# Altium schematic sheet zasilanie.SchDoc
size A4
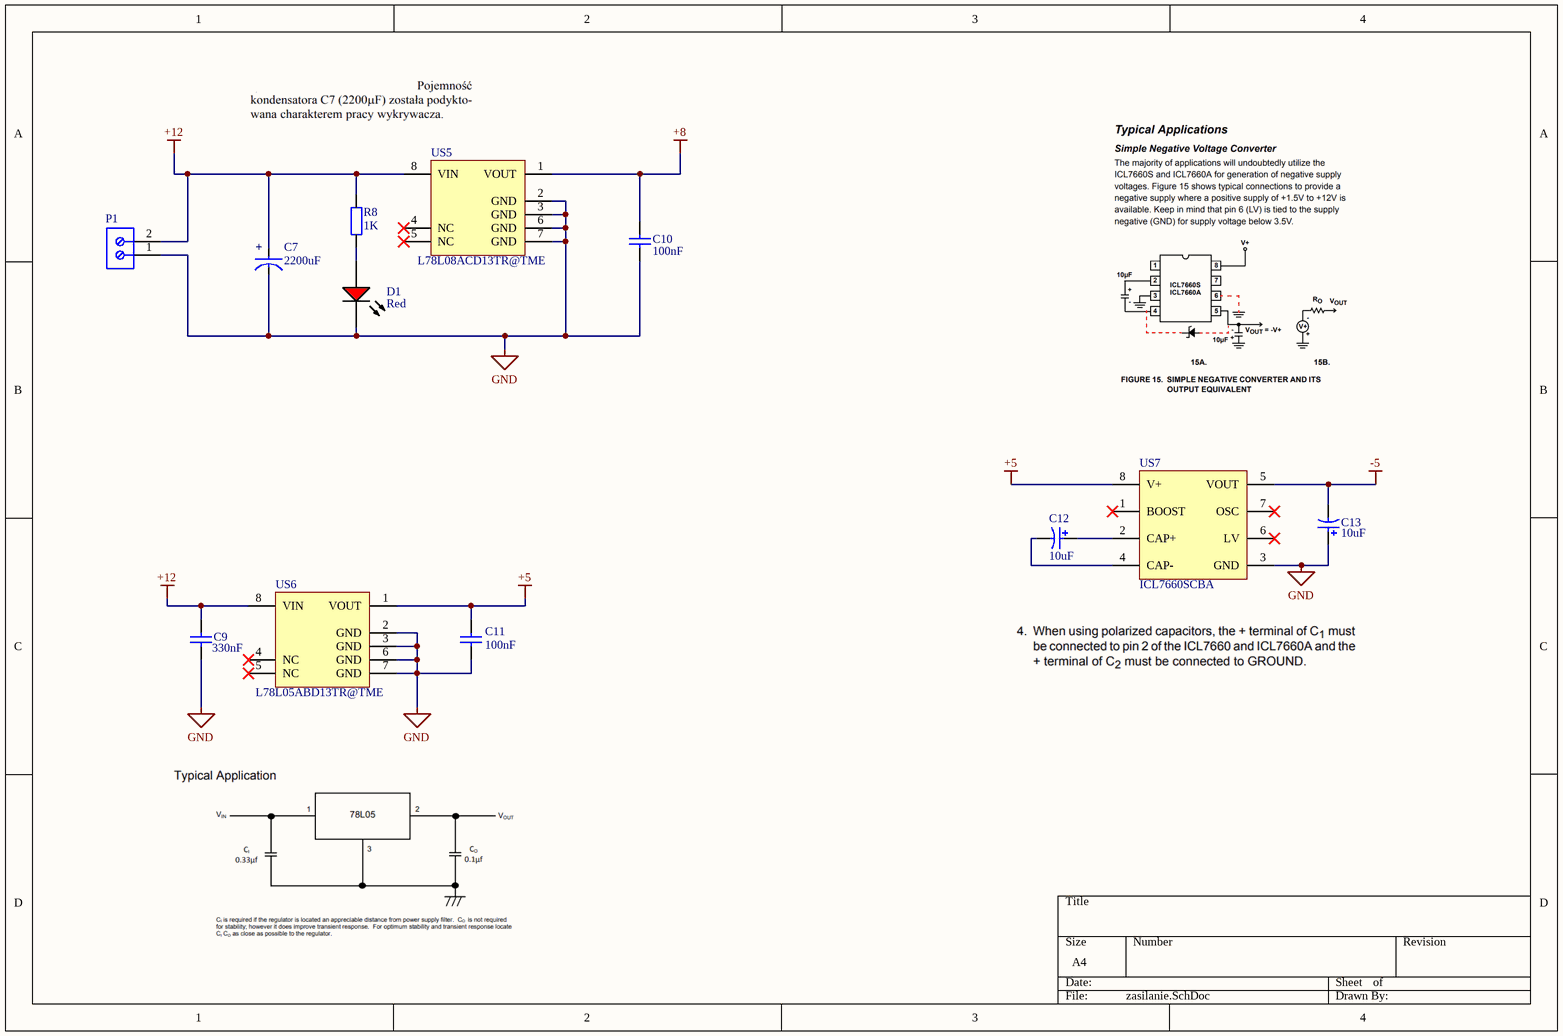
[diagram p0: zasilanie.SchDoc]

## Parts
C7  Capacitance: 2200uF  [18 X 25mm Radial 7.5mm]  (hidden comment: Cap Electrolytic)
C9  value 330nF  [CAPC1608X90X35ML15T15]  (hidden comment: 0603YD334KAT2A)
C10  Capacitance: 100nF  [0603]  (hidden comment: CL10B104KA8NNNC@TME)
C11  Capacitance: 100nF  [0603]  (hidden comment: CL10B104KA8NNNC@TME)
C12  Capacitance: 10uF  [PNSC-FK-V-D_V]  (hidden comment: EEEFK1H100P)
C13  Capacitance: 10uF  [PNSC-FK-V-D_V]  (hidden comment: EEEFK1H100P)
D1  LED Colour: Red  [VISH-TLMS1000_V]  (hidden comment: TLMS1000-GS08)
P1  282836-2@TME  [TECO-282836-2_V]  (value not drawn)
R8  value 1K  [R1206]  (hidden comment: 1206S4J0102T5E@TME)
US5  L78L08ACD13TR@TME  [SO8_M]
US6  L78L05ABD13TR@TME  [SO8_N]
US7  ICL7660SCBA  [INTS-SOIC-8_V]

## Nets
+5: C11.1 US6.1(VOUT) US7.8(V+)
+8: C10.1 US5.1(VOUT)
+12: C7.2(+) C9.1 P1.2(-) R8.2 US5.8(VIN) US6.8(VIN)
-5: C13.2 US7.5(VOUT)
GND: C7.1(-) C9.2 C10.2 C11.2 C13.1 D1.2(K) P1.1(+) US5.2(GND) US5.3(GND) US5.6(GND) US5.7(GND) US6.2(GND) US6.3(GND) US6.6(GND) US6.7(GND) US7.3(GND)
NetC12_1: C12.1 US7.2(CAP+)
NetC12_2: C12.2 US7.4(CAP-)
NetD1_1: D1.1(A) R8.1

Not connected (* = marked no-connect by the designer): US5 4(NC)* 5(NC)*; US6 4(NC)* 5(NC)*; US7 1(BOOST)* 6(LV)* 7(OSC)*

## Library data of the parts
C7 = Cap Electrolytic: CAPACITOR ALUM 2200UF 20% 35V RADIAL
C9 = CMP-2006-04538-1: Manufacturer: AVX Interconnect / Elco; Part Number: 0603YD334KAT2A
C10 C11 = Cap: Capacitor
C12 C13 = CMP-2000-06207-1: Aluminum Electrolytic Capacitor, 10 uF, +/- 20%, 50 V, 2-Pin SMD (Size Code D), -55 to 105 degC, RoHS, Tape and Reel; Manufacturer: Panasonic; Lifetime@Temperature: 2000Hrs@105°C; Type: Can; Rated Voltage: 50V; Ripple Current: 165mA; Impedance: 0.88O; Manufacturer URL: http://www.panasonic.com/; Mounting Technology: SurfaceMount; Datasheet URL: http://industrial.panasonic.com/cdbs/www-data/pdf/RDE0000/ABA0000C1181.pdf; Package Reference: FK-V-D; Series: FK; Operating Temp Range: -55to+105°C; Operating Temp-Max: 105°C; Datasheet Version: 03/2016; Package URL: http://industrial.panasonic.com/cdbs/www-data/pdf/RDE0000/DME0000COL48.pdf; Case Size/Dimension: Ø6.3x5.8mm; Package Description: 2-Pin Electrolytic Aluminum Capacitor, Body 6.6 x 6.6 mm
D1 = CMP-2000-07254-1: Low Current LED, 40 mW, 1.8 V, -40 to 100 degC, 2-Pin SMD (0603), RoHS, Tape and Reel; Manufacturer: Vishay; Lens Shape: Rectangular; Automotive Qualification Standard: AEC-Q100; Wavelength Typ: 636nm; SVHC: ToBeAdvised; Bulb Size: 1.6mmx0.8mm; Forward Voltage: 1.8V; Luminous Intensity: 4mcd; Forward Current If: 2mA; Viewing Angle: 80°; Datasheet Version: Rev. 1.7, 02/2011; Datasheet URL: https://datasheet.ciiva.com/5798/1698881-5798337.pdf; LED Mounting: SMD; Packaging: CutTape; Package Reference: TLMS1000; Manufacturer URL: http://www.vishay.com/; Mounting Technology: SurfaceMount; Product Range: -; Package Description: 2-Pin Surface Mount Device, Body 1.6 x 0.8 mm; MSL: MSL2-1year
P1 = CMP-1684-00017-1: Female Header, Pitch 5 mm, 1 x 2 Position, Height 10 mm, Tail Length 3.5 mm, Rohs, Bulk; Manufacturer: TE Connectivity; Wire Gauge: 16-30AWG; Product Training Modules: Wire-to-BoardEurostyleTerminalBlocks; Clamp Material - Plating: Brass-NickelPlated; Voltage: 300V; Mating Orientation: HorizontalwithBoard; Current: 13.5A; Pitch: 0.197"(5.00mm); Screw Thread: M3; 3D Model: 282836-2.pdf; Other Names: 5ULV-02B / A98076; Dynamic Catalog: BuchananSeries; Number of Levels: 1; Torque - Screw: 0.68Nm(6Lb-In); Featured Product: EurostyleTerminalBlockConnectors; Positions Per Level: 2; Wire Termination: Screw-RisingCageClamp; Datasheet URL: http://www.te.com.cn/commerce/DocumentDelivery/DDEController?Action=showdoc&DocId=Catalog+Section%7F1308389_EUROSTYLE_TERMINAL_BLOCKS%7F0607%7Fpdf%7FEnglish%7FENG_CS_1308389_EUROSTYLE_TERMINAL_BLOCKS_0607.pdf%7F282836-2; Color: Green; Family: TerminalBlocks-WiretoBoard; RoHS Information: 282836-2StatementofCompliance; Standard Package: 300; Contact Material - Plating: Brass-TinPlated; Manufacturer URL: http://www.te.com; Housing Material: Polyamide(PA66),Nylon6/6; Features: Interlocking(Side); Package Description: Female Header, Pitch 5 mm, 1 x 2 Position, Height 10 mm, Tail Length 3.5 mm; Mounting Type: ThroughHole; Package Reference: THD; Packaging: Bulk; Series: Buchanan; Category: Connectors,Interconnects; Screw Material - Plating: Brass-NickelPlated
R8 = Res: Resistor
US5 = CMP-0244-00234-1: Positive Voltage Regulator, 8V, 8-Pin SO, Tape and Reel; PackageVersion: 1/12/2002; DatasheetVersion: 1/02/2011; Code_IPC: SOIC127P600-8; PackageDescription: 8-Pin Small Outline Integrated Circuit 1.27 mm Pitch; ComponentLink3Description: Package Specification; Code_JEDEC: MS-012-AA; PackageReference: SO8; ComponentLink3URL: http://www.st.com/internet/com/TECHNICAL_RESOURCES/TECHNICAL_LITERATURE/PACKAGE_INFORMATION/CD00004680.pdf; ComponentLink1Description: Manufacturer URL; ComponentLink2Description: Datasheet; ComponentLink2URL: http://www.st.com/internet/com/TECHNICAL_RESOURCES/TECHNICAL_LITERATURE/DATASHEET/CD00000446.pdf; ComponentLink1URL: http://www.st.com
US6 = CMP-0244-00242-1: Positive Voltage Regulator, 5V, 8-Pin SO, Tape and Reel; ComponentLink2URL: http://www.st.com/internet/com/TECHNICAL_RESOURCES/TECHNICAL_LITERATURE/DATASHEET/CD00000446.pdf; ComponentLink3URL: http://www.st.com/internet/com/TECHNICAL_RESOURCES/TECHNICAL_LITERATURE/PACKAGE_INFORMATION/CD00004680.pdf; Code_IPC: SOIC127P600-8; PackageDescription: 8-Pin Small Outline Integrated Circuit 1.27 mm Pitch; ComponentLink3Description: Package Specification; ComponentLink2Description: Datasheet; DatasheetVersion: 1/02/2011; PackageVersion: 1/12/2002; Code_JEDEC: MS-012-AA; ComponentLink1URL: http://www.st.com; ComponentLink1Description: Manufacturer URL; PackageReference: SO8
US7 = CMP-2000-06437-1: Charge Pump Switching Regulator IC Positive or Negative Fixed, 1.5 to 12 V, 0 to 70 degC, RoHS, Tube; Manufacturer: Intersil; Number of Outputs: 1; Frequency - Switching: 10kHz,35kHz; Dynamic Catalog: InvertingIC; Current - Output: 45mA; Voltage - Input: 1.5V~12V; Output Type: Adjustable; Synchronous Rectifier: No; Voltage - Output: -1.5V~-12V,±3V~±24V; Package URL: http://www.intersil.com/content/dam/Intersil/documents/m8_1/m8.15.pdf; Standard Package: 98; Type: SwitchedCapacitor(ChargePump),Doubler,Inverting; Datasheet Version: 01/2013; Package Description: 8-Pin Small Outline Integrated Circuit, Body 4.9 x 3.9 mm, Pitch 1.27 mm; Category: IntegratedCircuits(ICs); Operating Temperature: 0°C~70°C; Mounting Technology: SurfaceMount; Package / Case: 8-SOIC(0.154",3.90mmWidth); Mounting Type: SurfaceMount; Series: -; Family: PMIC-VoltageRegulators-DCDCSwitchingRegulators; Packaging: Tube; PWM Type: -; Supplier Device Package: 8-SOIC; Datasheet URL: http://www.intersil.com/content/dam/intersil/documents/icl7/icl7660s-a.pdf; Package Reference: SOIC-8; Manufacturer URL: http://www.intersil.com/en.html